# Altium schematic sheet Power management.SchDoc
size A3
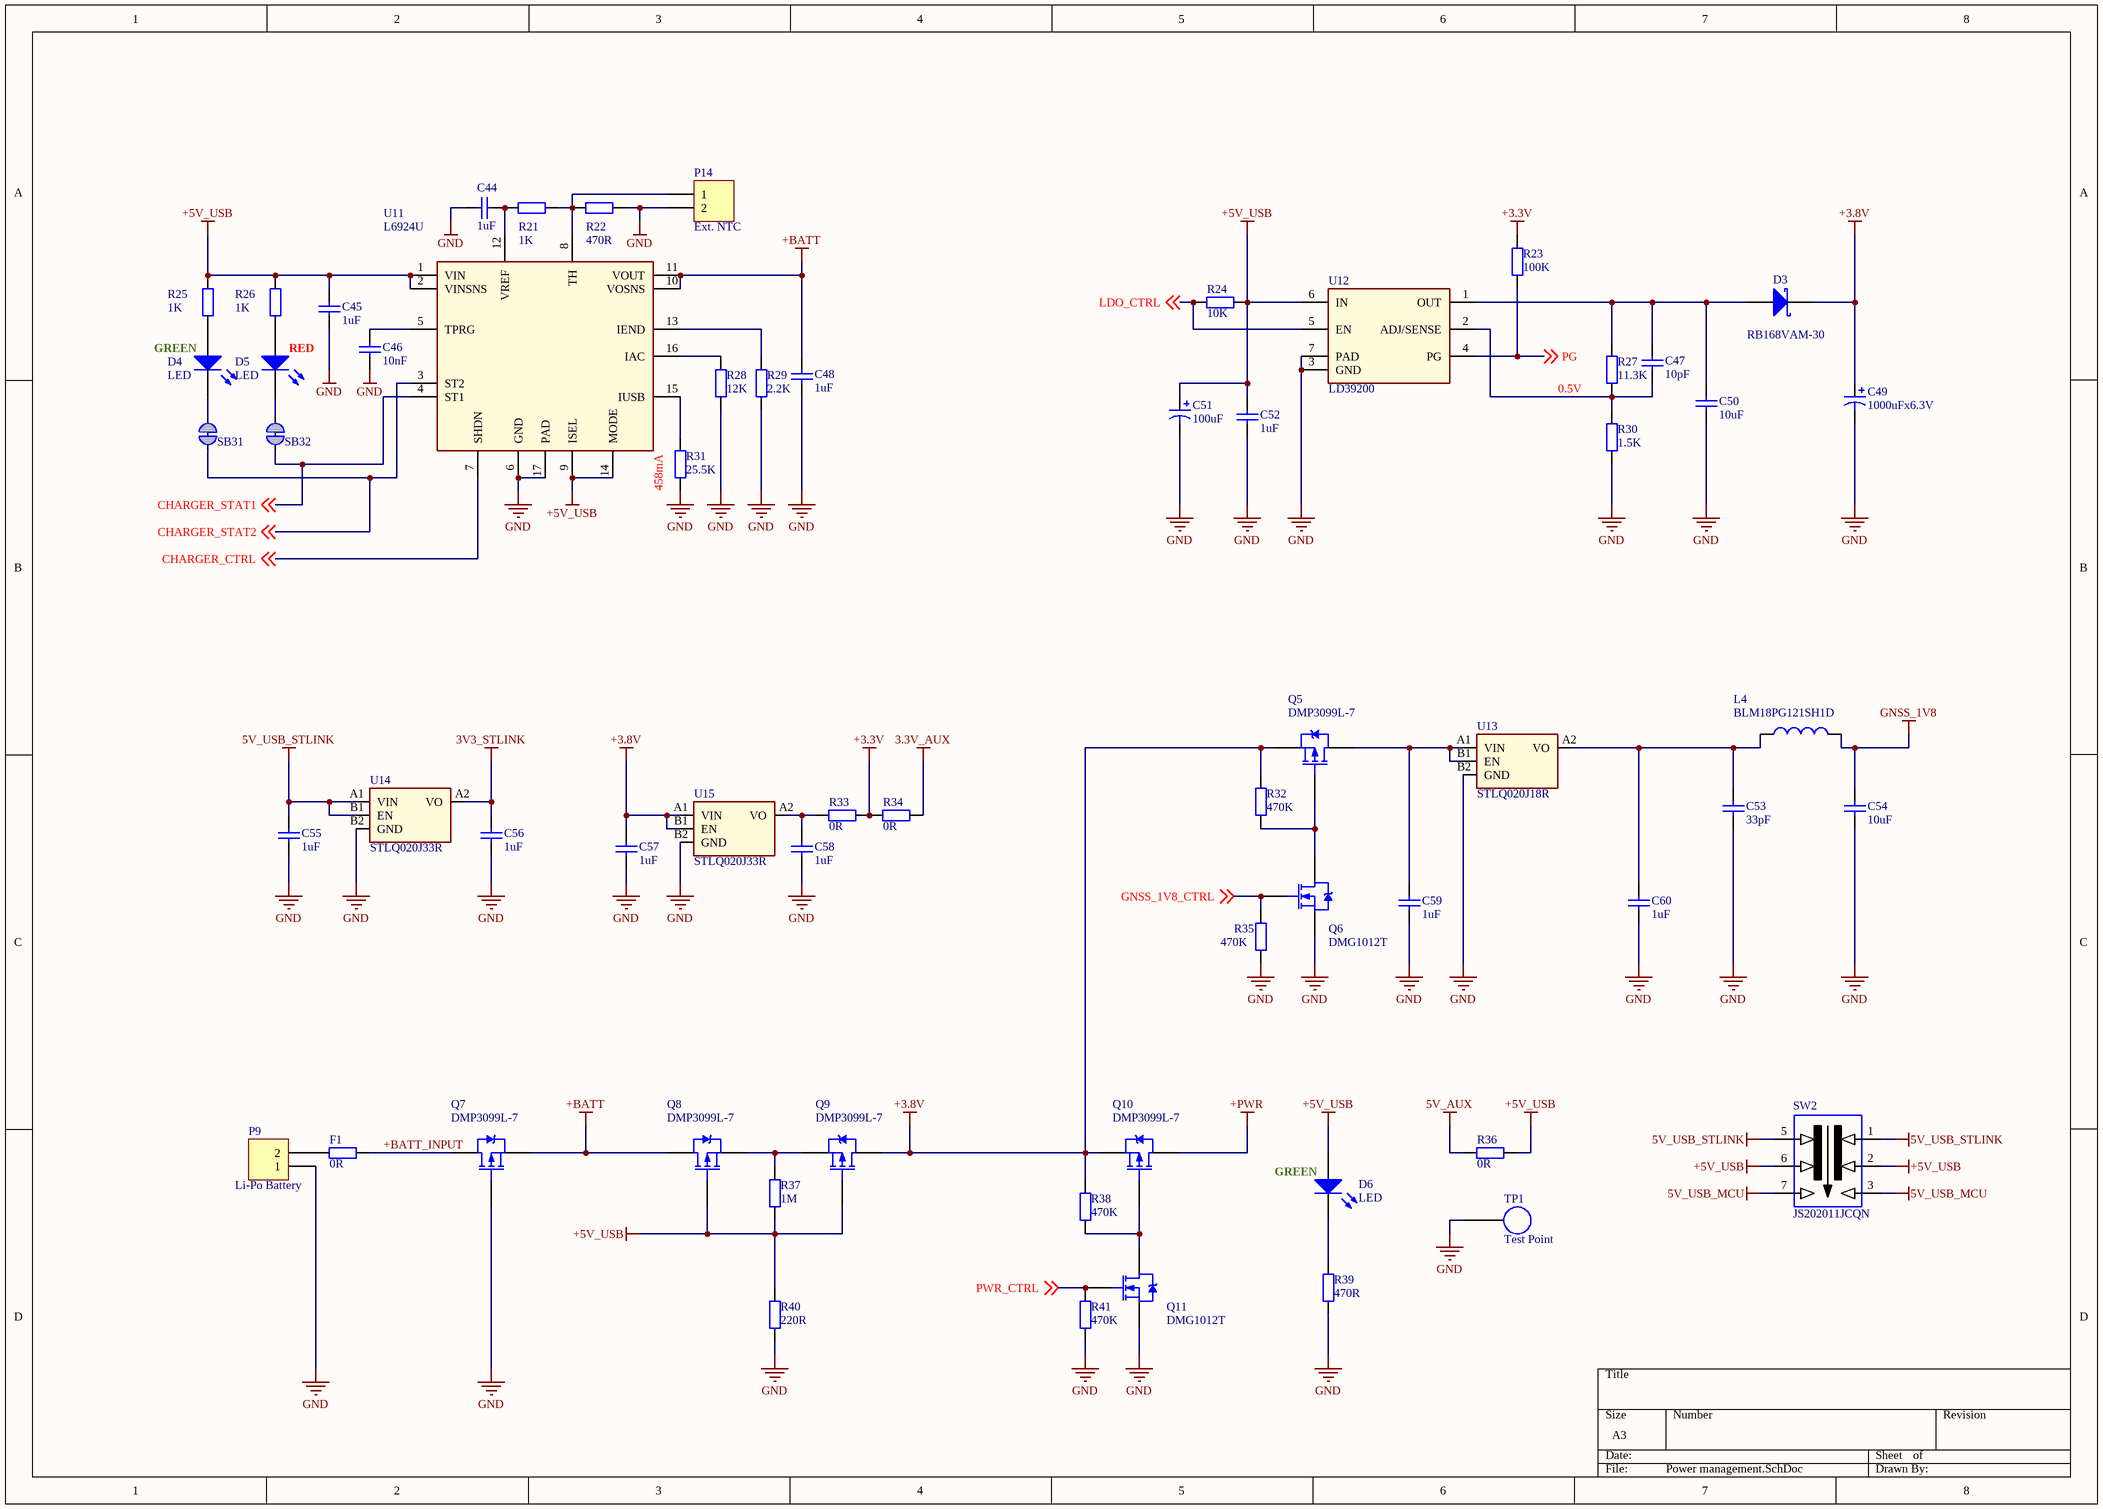
[diagram p0: Power management.SchDoc]

## Parts
C44  value 1uF  [C0402]  (hidden comment: Cap Semi)
C45  value 1uF  [C0402]  (hidden comment: Cap Semi)
C46  value 10nF  [C0402]  (hidden comment: Cap Semi)
C47  value 10pF  [C0402]  (hidden comment: Cap Semi)
C48  value 1uF  [C0402]  (hidden comment: Cap Semi)
C49  value 1000uFx6.3V  [7361-38]  (hidden comment: electrolytic capacitor)
C50  value 10uF  [C0402]  (hidden comment: Cap Semi)
C51  value 100uF  [Case-B]  (hidden comment: electrolytic capacitor)
C52  value 1uF  [C0402]  (hidden comment: Cap Semi)
C53  value 33pF  [C0402]  (hidden comment: Cap Semi)
C54  value 10uF  [C0402]  (hidden comment: Cap Semi)
C55  value 1uF  [C0402]  (hidden comment: Cap Semi)
C56  value 1uF  [C0402]  (hidden comment: Cap Semi)
C57  value 1uF  [C0402]  (hidden comment: Cap Semi)
C58  value 1uF  [C0402]  (hidden comment: Cap Semi)
C59  value 1uF  [C0402]  (hidden comment: Cap Semi)
C60  value 1uF  [C0402]  (hidden comment: Cap Semi)
D3  RB168VAM-30  [SOD323]
D4  LED  [PICOLED]
D5  LED  [PICOLED]
D6  LED  [PICOLED]
F1  value 0R  [R0603]  (hidden comment: Res2)
L4  value BLM18PG121SH1D  [L0603]  (hidden comment: Inductor)
P9  Li-Po Battery  [104238-0210  Molex]
P14  Ext. NTC  [HDR1X2H]  (no BOM)
Q5  DMP3099L-7  [SOT23_custom]
Q6  DMG1012T  [SOT-523_custom]
Q7  DMP3099L-7  [SOT23_custom]
Q8  DMP3099L-7  [SOT23_custom]
Q9  DMP3099L-7  [SOT23_custom]
Q10  DMP3099L-7  [SOT23_custom]
Q11  DMG1012T  [SOT-523_custom]
R21  value 1K  [R0402]  (hidden comment: Res2)
R22  value 470R  [R0402]  (hidden comment: Res2)
R23  value 100K  [R0402]  (hidden comment: Res2)
R24  value 10K  [R0402]  (hidden comment: Res2)
R25  value 1K  [R0402]  (hidden comment: Res2)
R26  value 1K  [R0402]  (hidden comment: Res2)
R27  value 11.3K  [R0402]  (hidden comment: Res2)
R28  value 12K  [R0402]  (hidden comment: Res2)
R29  value 2.2K  [R0402]  (hidden comment: Res2)
R30  value 1.5K  [R0402]  (hidden comment: Res2)
R31  value 25.5K  [R0402]  (hidden comment: Res2)
R32  value 470K  [R0402]  (hidden comment: Res2)
R33  value 0R  [R0402]  (hidden comment: Res2)
R34  value 0R  [R0402]  (hidden comment: Res2)
R35  value 470K  [R0402]  (hidden comment: Res2)
R36  value 0R  [R0402]  (hidden comment: Res2)
R37  value 1M  [R0402]  (hidden comment: Res2)
R38  value 470K  [R0402]  (hidden comment: Res2)
R39  value 470R  [R0402]  (hidden comment: Res2)
R40  value 220R  [R0402]  (hidden comment: Res2)
R41  value 470K  [R0402]  (hidden comment: Res2)
SB31  Solderbridge  [Solderbridge_Shorted]  (value not drawn)  (net tie, no BOM)
SB32  Solderbridge  [Solderbridge_Shorted]  (value not drawn)  (net tie, no BOM)
SW2  JS202011JCQN  [JS202011JCQN]
TP1  Test Point  [5019_keystone]
U11  L6924U  [VFQFPN16]
U12  LD39200  [DFN6]
U13  STLQ020J18R  [Flip-Chip4]
U14  STLQ020J33R  [Flip-Chip4]
U15  STLQ020J33R  [Flip-Chip4]

## Nets
3.3V_AUX: R34.1
3V3_STLINK: C56.1 U14.A2(VO)
5V_AUX: R36.2
5V_USB_MCU: SW2.3 SW2.7
5V_USB_STLINK: C55.1 SW2.1 SW2.5 U14.A1(VIN) U14.B1(EN)
+3.3V: R23.2 R33.1 R34.2
+3.8V: C49.1 C57.1 D3.2(K) Q5.3(S) Q9.1(D) Q10.3(S) R32.2 R38.2 U15.A1(VIN) U15.B1(EN)
+5V_USB: C45.1 C51.1 C52.2 D6.1(A) Q8.2(G) Q9.2(G) R24.2 R25.1 R26.1 R36.1 R37.2 R40.2 SW2.2 SW2.6 U11.1(VIN) U11.2(VINSNS) U11.9(ISEL) U11.14(MODE) U12.6(IN)
+BATT: C48.1 Q7.3(S) Q8.1(D) U11.10(VOSNS) U11.11(VOUT)
+PWR: Q10.1(D)
GND: C44.2 C45.2 C46.2 C48.2 C49.2 C50.1 C51.2 C52.1 C53.1 C54.2 C55.2 C56.2 C57.2 C58.2 C59.2 C60.2 P9.1 P14.2 Q6.3(S) Q7.2(G) Q11.3(S) R22.2 R28.2 R29.2 R30.2 R31.2 R35.1 R39.2 R40.1 R41.1 TP1.1 U11.6(GND) U11.17(PAD) U12.3(GND) U12.7(PAD) U13.B2(GND) U14.B2(GND) U15.B2(GND)
GNSS_1V8: C54.1 L4.2
+BATT_INPUT: F1.2 Q7.1(D)
CHARGER_CTRL: U11.7(SHDN) ; off-sheet CHARGER_CTRL
CHARGER_STAT1: SB32.2 U11.4(ST1) ; off-sheet CHARGER_STAT1
CHARGER_STAT2: SB31.2 U11.3(ST2) ; off-sheet CHARGER_STAT2
GNSS_1V8_CTRL: Q6.1(G) R35.2 ; off-sheet GNSS_1V8_CTRL
LDO_CTRL: R24.1 U12.5(EN) ; off-sheet LDO_CTRL
PG: R23.1 U12.4(PG) ; off-sheet PG
PWR_CTRL: Q11.1(G) R41.2 ; off-sheet PWR_CTRL
NetC44_1: C44.1 R21.1 U11.12(VREF)
NetC46_1: C46.1 U11.5(TPRG)
NetC47_1: C47.1 R27.2 R30.1 U12.2(ADJ/SENSE)
NetC47_2: C47.2 C50.2 D3.1(A) R27.1 U12.1(OUT)
NetC53_2: C53.2 C60.1 L4.1 U13.A2(VO)
NetC58_1: C58.1 R33.2 U15.A2(VO)
NetC59_1: C59.1 Q5.1(D) U13.A1(VIN) U13.B1(EN)
NetD4_1: D4.1(A) R25.2
NetD4_2: D4.2(K) SB31.1
NetD5_1: D5.1(A) R26.2
NetD5_2: D5.2(K) SB32.1
NetD6_2: D6.2(K) R39.1
NetF1_1: F1.1 P9.2
NetP14_1: P14.1 R21.2 R22.1 U11.8(TH)
NetQ5_2: Q5.2(G) Q6.2(D) R32.1
NetQ8_3: Q8.3(S) Q9.3(S) R37.1
NetQ10_2: Q10.2(G) Q11.2(D) R38.1
NetR28_1: R28.1 U11.16(IAC)
NetR29_1: R29.1 U11.13(IEND)
NetR31_1: R31.1 U11.15(IUSB)

## Notes on the sheet
- GREEN
- (near D5) RED
- 0.5V
- 458mA
- (near D6) GREEN

## Library data of the parts
C44-C46 C48 = Cap Semi: Capacitor (Semiconductor SIM Model); Manufacturer: Samsung Electronics; Manufacturer Part No.: CL05B102KB5NNND; Part Description: Ceramic Capacitor; Specification: X5R, 6.3V, 10%; Supplier: Rutronik; Supplier part number: KKK22306; Link: https://www.rutronik24.com/product/samsung+em/cl05b102kb5nnnd/7450031.html
C47 = Cap Semi: Capacitor (Semiconductor SIM Model); Manufacturer: YAGEO; Manufacturer Part No.: CC0402JRNPO9BN100; Part Description: Ceramic Capacitor; Specification: NP0, 6.3V, 5%; Supplier: Rutronik; Supplier part number: KKK14556; Link: https://www.rutronik24.com/product/yageo/cc0402jrnpo9bn100/29735.html
C49 = Cap Pol1: Manufacturer: AVX; Manufacturer Part No.: TPSV108M006R0050; Part Description: Tantalum Capacitor; Specification: 6,3V 20%; Supplier: Rutronik; Supplier part number: TPSV108M006R0050; Link: https://www.rutronik24.com/product/avx/tpsv108m006r0050/11647835.html
C50 C52 C54 = Cap Semi: Capacitor (Semiconductor SIM Model); Manufacturer: Samsung Electronics; Manufacturer Part No.: CL05A106MP5NUNC; Part Description: Ceramic Capacitor; Specification: X5R, 6.3V, 20%; Supplier: Rutronik; Supplier part number: KKS2857; Link: https://www.rutronik24.com/product/samsung+em/cl05a106mp5nunc/32408.html
C51 = Cap Pol1: Manufacturer: AVX; Manufacturer Part No.: TPSB107K006R0400; Part Description: Tantalum Capacitor; Specification: 6,3V 20%; Supplier: Rutronik; Supplier part number: KTA5959; Link: https://www.rutronik24.com/product/avx/tpsb107k006r0400/3688840.html
C53 = Cap Semi: Capacitor (Semiconductor SIM Model); Manufacturer: AVX; Manufacturer Part No.: 04025A330JAT2A; Part Description: Ceramic Capacitor; Specification: NP0, 6.3V, 5%; Supplier: Rutronik; Supplier part number: KKK13594; Link: https://www.rutronik24.com/product/avx/04025a330jat2a/3692730.html
C55-C60 = Cap Semi: Capacitor (Semiconductor SIM Model); Manufacturer: Samsung Electronics; Manufacturer Part No.: CL05A225MQ5NNNC; Part Description: Ceramic Capacitor; Specification: X5R, 6.3V, 10%; Supplier: Rutronik; Supplier part number: KKS2678; Link: https://www.rutronik24.com/product/samsung+em/cl05a225mq5nnnc/32280.html
D3 = D Schottky: Schottky Diode; Manufacturer: ROHM; Part Description: Low VF Schottky Barrier Rectifier; Specification: 30V, 1A; Manufacturer Part No.: RB168VAM-30; Supplier: Rutronik; Supplier part number: RB168VAM-30; Value: RB168VAM-30; Link: http://rohmfs.rohm.com/en/products/databook/datasheet/discrete/diode/schottky_barrier/rb168vam-30tr-e.pdf
D4 D6 = LED2: Typical SMD LED; Manufacturer: ROHM; Manufacturer Part No.: SML-P13PTT86R; Specification: Green, 20mA; Value: SML-P13PTT86R; Supplier: Rutronik; Supplier part number: LED26047; Part Description: Typical SMD LED; Link: https://www.rutronik24.com/product/rohm/sml-p13ptt86r/11064312.html
D5 = LED2: Typical SMD LED; Manufacturer: ROHM; Manufacturer Part No.: SML-P12UTT86; Specification: Red, 20mA; Value: SML-P12UTT86; Supplier: Rutronik; Supplier part number: LED24884; Part Description: Typical SMD LED; Link: https://www.rutronik24.com/product/rohm/sml-p12utt86/8485748.html
F1 R33 R34 R36 = Res2: Manufacturer: YAGEO; Manufacturer Part No.: RC0402FR-070RL; Part Description: Thick Film Resistor; Specification: 5% 0,063W; Supplier: Rutronik; Supplier part number: WRC53079; Link: https://www.rutronik24.com/product/yageo/rc0402fr-070rl/5183530.html
L4 = Inductor: Manufacturer: muRata; Part Description: Ferrite Bead; Specification: 120R, 2A; Manufacturer Part No.: BLM18PG121SH1D; Supplier: Rutronik; Supplier part number: FE3867; Link: https://www.rutronik24.com/product/murata/blm18pg121sh1d/5885588.html
P9 = Header 2: Manufacturer: Molex; Manufacturer Part No.: 104238-0210; Part Description: Terminal; Specification: 2 pins, 5 mm pitch; Value: 104238-0210; Supplier: Rutronik; Supplier part number: COREC38239; Link: https://www.molex.com/molex/products/datasheet.jsp?part=active/1042380210_PCB_RECEPTACLES.xml
P14 = Header 2H: Header, 2-Pin, Right Angle
Q5 Q7-Q10 = IRF5NJ5305: Manufacturer: Diodes Inc.; Part Description: P-Channel MOSFET; Specification: -30V, -3.8A; Manufacturer Part No.: DMP3099L-7; Supplier: Rutronik; Supplier part number: TMOSS6836; Value: DMP3099L-7; Link: https://www.rutronik24.com/product/diodes+inc/dmp3099l-7/5168905.html
Q6 Q11 = NMOS-2: N-Channel Power MOSFET; Manufacturer: Diodes Inc.; Manufacturer Part No.: DMG1012T-7; Part Description: N-Channel MOSFET; Specification: 20V, 0.63A; Value: DMG1012T-7; Supplier: Rutronik; Supplier part number: TMOSS6623; Link: https://www.rutronik24.com/product/diodes+inc/dmg1012t-7/5168665.html
R21 R22 R25 R26 R28 R29 R31 R39 = Res2: Manufacturer: ASJ; Manufacturer Part No.: CR10-471-JK; Part Description: Thick Film Resistor; Specification: 5% 0,063W; Supplier: Rutronik; Supplier part number: WRC41425; Link: https://www.rutronik24.com/product/asj/cr10-471-jk/54391.html
R23 = Res2: Manufacturer: ASJ; Manufacturer Part No.: CR10-104-JK; Part Description: Thick Film Resistor; Specification: 5% 0,063W; Supplier: Rutronik; Supplier part number: WRC34858; Link: https://www.rutronik24.com/product/asj/cr10-104-jk/51752.html
R24 R27 = Res2: Manufacturer: ASJ; Manufacturer Part No.: CR10-103-JK; Part Description: Thick Film Resistor; Specification: 5% 0,063W; Supplier: Rutronik; Supplier part number: WRC40976; Link: https://www.rutronik24.com/product/asj/cr10-103-jk/54295.html
R30 = Res2: Manufacturer: YAGEO; Manufacturer Part No.: RC0402JR-071K5L; Part Description: Thick Film Resistor; Specification: 5% 0,063W; Supplier: Rutronik; Supplier part number: WRC33836; Link: https://www.rutronik24.com/product/yageo/rc0402jr-071k5l/51006.html
R32 R35 R38 R41 = Res2: Manufacturer: ASJ; Manufacturer Part No.: CR10-474-JK; Part Description: Thick Film Resistor; Specification: 5% 0,063W; Supplier: Rutronik; Supplier part number: WRC35429; Link: https://www.rutronik24.com/product/asj/cr10-474-jk/52065.html
R37 = Res2: Manufacturer: ASJ; Manufacturer Part No.: CR10-105-JK; Part Description: Thick Film Resistor; Specification: 5% 0,063W; Supplier: Rutronik; Supplier part number: WRC35254; Link: https://www.rutronik24.com/product/asj/cr10-105-jk/51971.html
R40 = Res2: Manufacturer: ASJ; Manufacturer Part No.: CR10-221-JK; Part Description: Thick Film Resistor; Specification: 5% 0,063W; Supplier: Rutronik; Supplier part number: WRC35108; Link: https://www.rutronik24.com/product/asj/cr10-221-jk/51883.html
SB31 SB32 = Solderbridge Shorted: Manufacturer: *; Value: Solderbridge; Supplier: *; Supplier part number: *
SW2 = JS202011JCQN: Sub-Miniature Slide Switch, VERTICAL MOUNT SMT - J BEND; Manufacturer: CK Switches; Specification: 6V DC, 0.3A; Link: https://www.ckswitches.com/media/1422/js.pdf; Manufacturer Part No.: JS202011JCQN; Part Description: VERTICAL MOUNT SMT - J BEND; Supplier: Rutronik; Supplier part number: SWITCH10809; Value: JS202011JCQN
TP1 = 5019: SMD Test Point; Manufacturer: Keystone Electrincs; Part Description: SMT Test Point; Specification: 3.81*2.03; Value: 5019; Manufacturer Part No.: 5019; Supplier: Rutronik; Supplier part number: BAT4950; Link: https://www.rutronik24.com/product/keystone/5019/7028403.html
U11 = L6924D: Battery charger system / with integrated power switch for Li-Ion/Li-Polymer; Manufacturer: STMicroelectronics; Part Description: USB compatible battery charger system  with integrated power switch for Li-Ion/Li-Polymer; Specification: 12V, 1A, Li-PO; Link: https://www.rutronik24.com/product/st/l6924utr/8297844.html; Manufacturer Part No.: L6924U; Supplier: Rutronik; Supplier part number: ICPWM6861; Value: L6924U
U12 = LD39200: 2 A high PSRR ultra low drop linear regulator with reverse current protection; Manufacturer: STMicroelectronics; Manufacturer Part No.: LD39200PUR; Specification: 2A ADJ.; Value: LD39200PUR; Link: https://www.rutronik24.com/product/st/ld39200pur/8309892.html; Part Description: 2 A high PSRR ultra low drop linear regulator with reverse current protection; Supplier: Rutronik; Supplier part number: ICSPR10216
U13 = STLQ020: LDO; Manufacturer: STMicroelectronics; Part Description: 200 mA ultra-low quiescent current LDO; Specification: 1.8V, 200mA; Manufacturer Part No.: STLQ020J18R; Supplier: Rutronik; Supplier part number: ICSPR10227; Value: STLQ020J18R; Link: https://www.rutronik24.com/product/st/stlq020j18r/10086303.html
U14 U15 = STLQ020: LDO; Manufacturer: STMicroelectronics; Part Description: 200 mA ultra-low quiescent current LDO; Specification: 3.3V, 200mA; Manufacturer Part No.: STLQ020J33R; Supplier: Rutronik; Supplier part number: STLQ020J33R; Value: STLQ020J33R; Link: https://www.rutronik24.com/product/st/stlq020j33r/12065124.html